# Altium project ESP32-S3-DevKitC-1 v1.1.PrjPcb
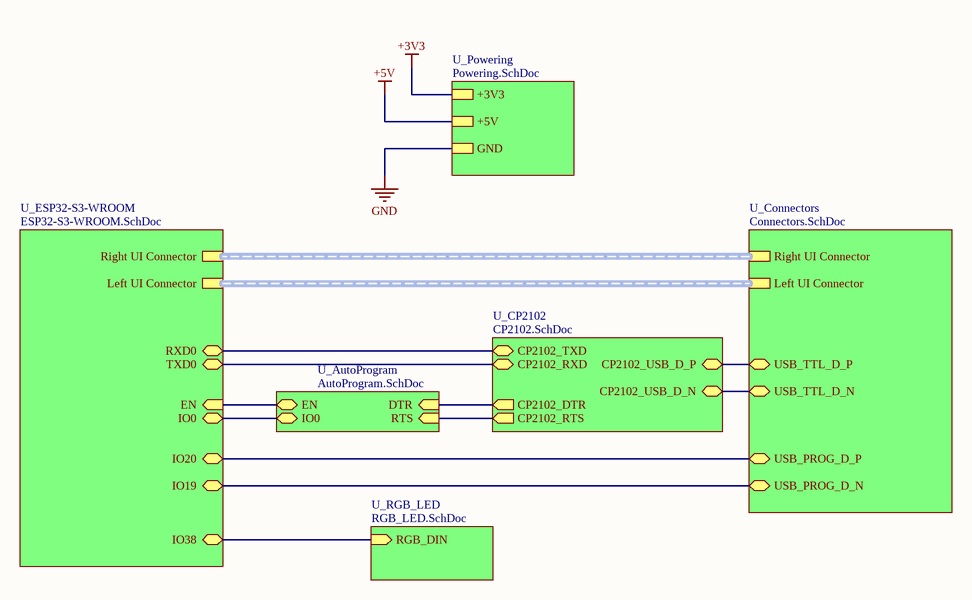
[diagram p0: Master.SchDoc]
Designer: Youssif Hossam; Version: 1.1
7 sheets, 50 parts. Net scope: hierarchical (ports join the sheet entries above them; power ports are global).
Board file: ESP32-S3-DevKitC-1.PcbDoc
Sheets:
  Master.SchDoc
    U_ESP32-S3-WROOM = ESP32-S3-WROOM.SchDoc
    U_Connectors = Connectors.SchDoc
    U_CP2102 = CP2102.SchDoc
    U_Powering = Powering.SchDoc
    U_RGB_LED = RGB_LED.SchDoc
    U_AutoProgram = AutoProgram.SchDoc

## Sheet Master.SchDoc
size A; SheetNumber: 1; SheetTotal: 7

### Sub-sheets
U_AutoProgram = AutoProgram.SchDoc: DTR (in), RTS (in), EN (bidir), IO0 (bidir)
U_Connectors = Connectors.SchDoc: Right UI Connector (harness Right UI Connector), Left UI Connector (harness Left UI Connector), USB_TTL_D_P (bidir), USB_TTL_D_N (bidir), USB_PROG_D_P (bidir), USB_PROG_D_N (bidir)
U_CP2102 = CP2102.SchDoc: CP2102_USB_D_P (bidir), CP2102_USB_D_N (bidir), CP2102_TXD (bidir), CP2102_RXD (bidir), CP2102_RTS (out), CP2102_DTR (out)
U_ESP32-S3-WROOM = ESP32-S3-WROOM.SchDoc: Right UI Connector (harness Right UI Connector), Left UI Connector (harness Left UI Connector), EN (in), RXD0 (bidir), TXD0 (bidir), IO0 (bidir), IO19 (bidir), IO20 (bidir), IO38 (bidir)
U_Powering = Powering.SchDoc: +3V3, +5V, GND
U_RGB_LED = RGB_LED.SchDoc: RGB_DIN (in)

### Nets
CP2102_RES_RXD: sheet U_ESP32-S3-WROOM/TXD0, sheet U_CP2102/CP2102_RXD
CP2102_RES_TXD: sheet U_ESP32-S3-WROOM/RXD0, sheet U_CP2102/CP2102_TXD
CP2102_USB_D_N: sheet U_Connectors/USB_TTL_D_N, sheet U_CP2102/CP2102_USB_D_N
CP2102_USB_D_P: sheet U_Connectors/USB_TTL_D_P, sheet U_CP2102/CP2102_USB_D_P
DTR: sheet U_CP2102/CP2102_DTR, sheet U_AutoProgram/DTR
EN: sheet U_ESP32-S3-WROOM/EN, sheet U_AutoProgram/EN
IO0: sheet U_ESP32-S3-WROOM/IO0, sheet U_AutoProgram/IO0
IO38: sheet U_ESP32-S3-WROOM/IO38, sheet U_RGB_LED/RGB_DIN
RTS: sheet U_CP2102/CP2102_RTS, sheet U_AutoProgram/RTS
USB1_D_N: sheet U_ESP32-S3-WROOM/IO19, sheet U_Connectors/USB_PROG_D_N
USB1_D_P: sheet U_ESP32-S3-WROOM/IO20, sheet U_Connectors/USB_PROG_D_P

### Buses and harness runs
harness sheet U_Connectors/Left UI Connector = sheet U_ESP32-S3-WROOM/Left UI Connector
harness sheet U_Connectors/Right UI Connector = sheet U_ESP32-S3-WROOM/Right UI Connector

## Sheet ESP32-S3-WROOM.SchDoc
size A; SheetNumber: 2; SheetTotal: 7
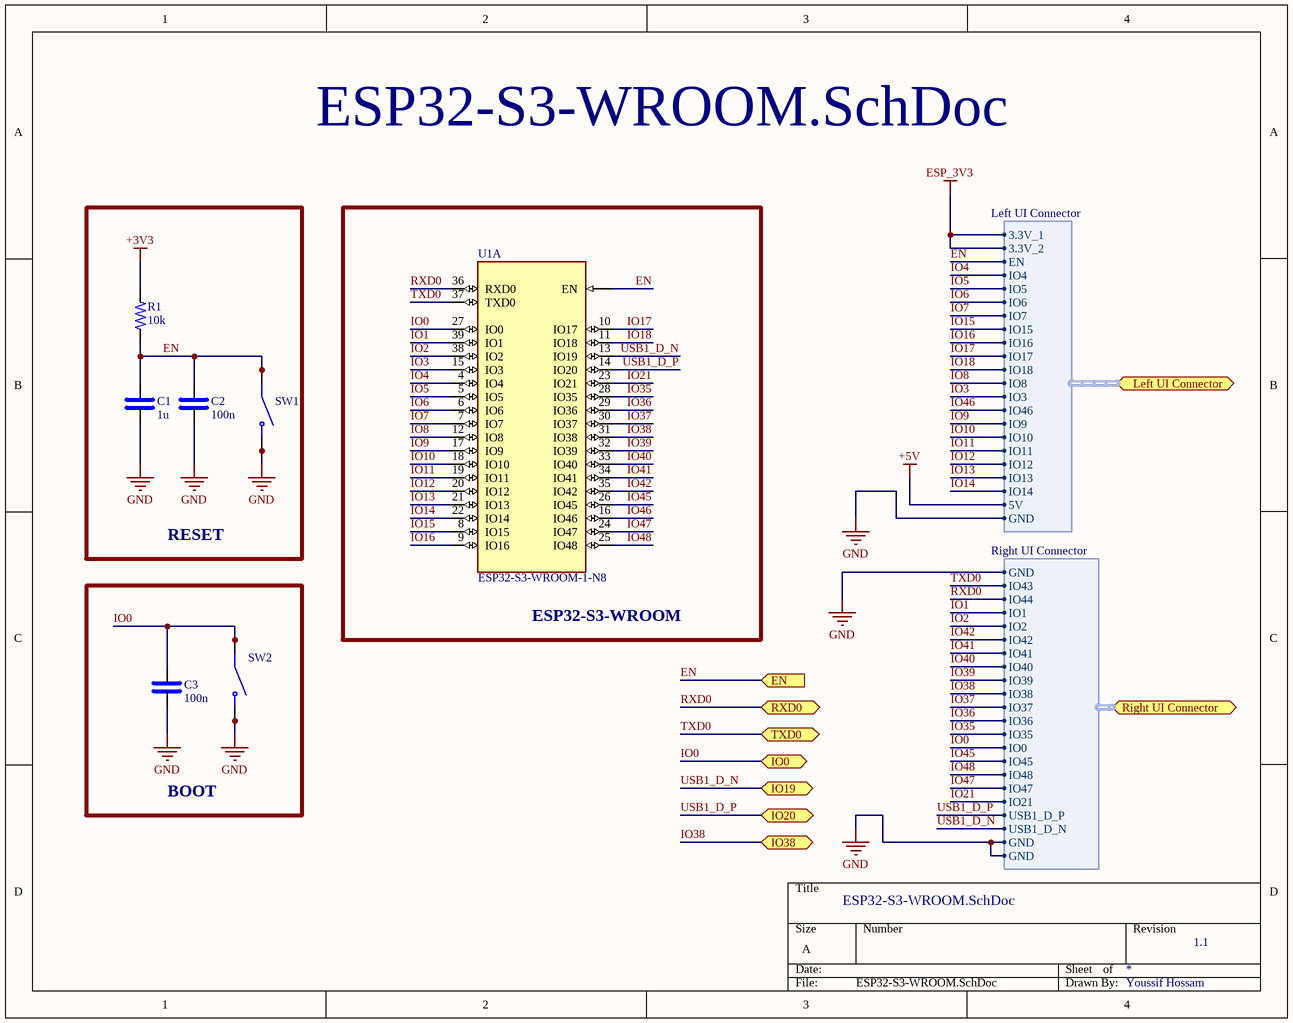
[diagram p1: ESP32-S3-WROOM.SchDoc]

### Parts
C1  1u  [FP-GCJ188-0_2-IPC_C]
C2  100n  [0402 CAP]
C3  100n  [0402 CAP]
R1  10k  [0402 RES]
SW1  KMR731NGLFS  [SW_KMR731NGLFS]  (value not drawn)
SW2  KMR731NGLFS  [SW_KMR731NGLFS]  (value not drawn)
U1  ESP32-S3-WROOM-1-N8  [XCVR_ESP32-S3-WROOM-1-N8]  (part A of 2)

### Blocks framed on the sheet
RESET: C1 C2 R1 SW1
ESP32-S3-WROOM: U1
BOOT: C3 SW2

### Ports
EN (in, see Master[2C], AutoProgram[4B]), IO0 (bidir, see Master[2C], AutoProgram[4B]), IO19 (bidir, see Master[2C]), IO20 (bidir, see Master[2C]), IO38 (bidir, see Master[2C]), Left UI Connector (bidir, harness Left UI Connector, see Master[2B], Connectors[2B]), Right UI Connector (bidir, harness Right UI Connector, see Master[2B], Connectors[4B]), RXD0 (bidir, see Master[2C]), TXD0 (bidir, see Master[2C])

### Harnesses
Right UI Connector: GND, IO43, IO44, IO1, IO2, IO35, IO36, IO37, IO38, IO39, IO40, IO41, IO42, IO0, IO45, IO48, IO47, USB1_D_N, USB1_D_P, IO21, GND, GND
Left UI Connector: 3.3V_1, 3.3V_2, EN, IO4, IO5, IO6, IO7, IO15, IO16, IO17, IO18, IO8, IO3, IO46, IO9, IO10, IO11, IO12, IO13, IO14, 5V, GND

### Nets
+3V3: R1.2
ESP_3V3: port Left UI Connector.3.3V_1, port Left UI Connector.3.3V_2
GND: C1.1 C2.1 C3.1 SW1.1(NO) SW1.2(NO) SW2.1(NO) SW2.2(NO) ; port Right UI Connector.GND, port Left UI Connector.GND
EN: C1.2 C2.2 R1.1 SW1.3(COM) SW1.4(COM) U1.3(EN) ; port EN, port Left UI Connector.EN
IO0: C3.2 SW2.3(COM) SW2.4(COM) U1.27(IO0) ; port IO0, port Right UI Connector.IO0
IO1: U1.39(IO1) ; port Right UI Connector.IO1
IO2: U1.38(IO2) ; port Right UI Connector.IO2
IO3: U1.15(IO3) ; port Left UI Connector.IO3
IO4: U1.4(IO4) ; port Left UI Connector.IO4
IO5: U1.5(IO5) ; port Left UI Connector.IO5
IO6: U1.6(IO6) ; port Left UI Connector.IO6
IO7: U1.7(IO7) ; port Left UI Connector.IO7
IO8: U1.12(IO8) ; port Left UI Connector.IO8
IO9: U1.17(IO9) ; port Left UI Connector.IO9
IO10: U1.18(IO10) ; port Left UI Connector.IO10
IO11: U1.19(IO11) ; port Left UI Connector.IO11
IO12: U1.20(IO12) ; port Left UI Connector.IO12
IO13: U1.21(IO13) ; port Left UI Connector.IO13
IO14: U1.22(IO14) ; port Left UI Connector.IO14
IO15: U1.8(IO15) ; port Left UI Connector.IO15
IO16: U1.9(IO16) ; port Left UI Connector.IO16
IO17: U1.10(IO17) ; port Left UI Connector.IO17
IO18: U1.11(IO18) ; port Left UI Connector.IO18
IO21: U1.23(IO21) ; port Right UI Connector.IO21
IO35: U1.28(IO35) ; port Right UI Connector.IO35
IO36: U1.29(IO36) ; port Right UI Connector.IO36
IO37: U1.30(IO37) ; port Right UI Connector.IO37
IO38: U1.31(IO38) ; port IO38, port Right UI Connector.IO38
IO39: U1.32(IO39) ; port Right UI Connector.IO39
IO40: U1.33(IO40) ; port Right UI Connector.IO40
IO41: U1.34(IO41) ; port Right UI Connector.IO41
IO42: U1.35(IO42) ; port Right UI Connector.IO42
IO45: U1.26(IO45) ; port Right UI Connector.IO45
IO46: U1.16(IO46) ; port Left UI Connector.IO46
IO47: U1.24(IO47) ; port Right UI Connector.IO47
IO48: U1.25(IO48) ; port Right UI Connector.IO48
RXD0: U1.36(RXD0) ; port RXD0, port Right UI Connector.IO44  [project net CP2102_RES_TXD]
TXD0: U1.37(TXD0) ; port TXD0, port Right UI Connector.IO43  [project net CP2102_RES_RXD]
USB1_D_N: U1.13(IO19) ; port IO19, port Right UI Connector.USB1_D_N
USB1_D_P: U1.14(IO20) ; port IO20, port Right UI Connector.USB1_D_P

### Library data of the parts
C1 = 0603 SMD CAP: Ceramic Capacitor, Multilayer, Ceramic, 16V, 10% +Tol, 10% -Tol, X5R, 15% TC, 1uF, Surface Mount, 0402; Manufacturer: Murata; Manufacturer Part Number: GRM188R61E106KA73D; Material: 4241ConductorMaterial; Dielectric: 1537DielectricType; Voltage Rating (DC): 25V; Multilayer: Yes; Supplier: Mouser; Supplier Part Number: 81-GRM188R61E106KA3D; RoHS: Yes; Category: Ceramic Capacitors; Stock: 343973; Pricing: 1=0.22, 10=0.073, 50=0.073, 100=0.054, 1000=0.05, 10000=0.038 (USD); Length: 1.6mm; Width: 800um; Height: 1mm; Thickness: 800um; ComponentLink1URL: https://datasheet.octopart.com/GRM188R61E106KA73D-Murata-datasheet-149523249.pdf?src-supplier=Newark; ComponentLink1Description: https://datasheet.octopart.com/GRM188R61E106KA73D-Murata-datasheet-149523249.pdf?src-supplier=Newark; ComponentLink2URL: https://search.murata.co.jp/Ceramy/image/img/A01X/G101/ENG/GRM188R61E106KA73-01.pdf?src-supplier=Digikey; ComponentLink2Description: https://search.murata.co.jp/Ceramy/image/img/A01X/G101/ENG/GRM188R61E106KA73-01.pdf?src-supplier=Digikey; ComponentLink3URL: https://datasheet.octopart.com/GRM188R61E106KA73D-Murata-datasheet-165579666.pdf?src-supplier=TME; ComponentLink3Description: https://datasheet.octopart.com/GRM188R61E106KA73D-Murata-datasheet-165579666.pdf?src-supplier=TME; Mounting Technology: Surface Mount; Pins: 2; Dielectric Material: Ceramic; Package Shape: Rectangular; Case/Package: 0402; Terminal Finish: Nickel; Min Operating Temperature: -55°C; Max Operating Temperature: 85°C; JESD-609 Code: e3; Value: 1uF; Capacitor Type: Ceramic; Tolerance  (fill in as +-): 10%; Package Style: SMTMeter; Packaging: Tape and Reel; Tolerance (fill in as +-): 10%; Rated DC Voltage (URdc): 16V; Temperature Characteristics Code: X5R; Termination: Wraparound; Reach SVHC Compliant: Yes; RoHS Compliant: Yes; ComponentLink4URL: https://datasheet.ciiva.com:443/pdfs/VipMasterIC/IC/TAIY/TAIY-S-A0009096450/TAIY-S-A0009096597-1.pdf?src-supplier=IHS+Markit; ComponentLink4Description: https://datasheet.ciiva.com:443/pdfs/VipMasterIC/IC/TAIY/TAIY-S-A0009096450/TAIY-S-A0009096597-1.pdf?src-supplier=IHS+Markit; ComponentLink5URL: https://datasheet.ciiva.com/134/emk105bj105kv-f-ss-134209.pdf?src-supplier=Digikey; ComponentLink5Description: https://datasheet.ciiva.com/134/emk105bj105kv-f-ss-134209.pdf?src-supplier=Digikey; ComponentLink6URL: https://datasheet.ciiva.com/15920/964emk105bj105kv-f-15920402.pdf?src-supplier=Onlinecomponents.com; ComponentLink6Description: https://datasheet.ciiva.com/15920/964emk105bj105kv-f-15920402.pdf?src-supplier=Onlinecomponents.com; ComponentLink7URL: https://datasheet.ciiva.com/26871/getdatasheetpartid-638287-26871289.pdf?src-supplier=Verical; ComponentLink7Description: https://datasheet.ciiva.com/26871/getdatasheetpartid-638287-26871289.pdf?src-supplier=Verical; ComponentLink8URL: https://datasheet.ciiva.com/30259/265emk105bj105kv-f-30259872.pdf?src-supplier=Onlinecomponents.com; ComponentLink8Description: https://datasheet.ciiva.com/30259/265emk105bj105kv-f-30259872.pdf?src-supplier=Onlinecomponents.com; ComponentLink9URL: https://datasheet.ciiva.com/7657/1497285-7657320.pdf?src-supplier=Element14; ComponentLink9Description: https://datasheet.ciiva.com/7657/1497285-7657320.pdf?src-supplier=Element14; ComponentLink10URL: https://datasheet.ciiva.com/22694/1497285-22694239.pdf?src-supplier=Element14; ComponentLink10Description: https://datasheet.ciiva.com/22694/1497285-22694239.pdf?src-supplier=Element14; ComponentLink11URL: https://datasheet.ciiva.com/5424/mlcc01-e-5424190.pdf?src-supplier=Mouser; ComponentLink11Description: https://datasheet.ciiva.com/5424/mlcc01-e-5424190.pdf?src-supplier=Mouser
C2 C3 = 0402 SMD Capacitor: Multilayer Ceramic Capacitor, 0.1 uF, 25 V, ï¿½ 10%, X7R, 0402 [1005 Metric]; Manufacturer: Samsung; Manufacturer Part Number: CL05B104KA5NNNC; Material: 4241ConductorMaterial; Value: 100nF; Voltage Rating: 25V; ComponentLink1Description: Link; ComponentLink1URL: *; Supplier: Digikey; Supplier Part Number: 1276-6720-1-ND; RoHS: Yes; Category: Ceramic Capacitors; Stock: 9938397; Pricing: 1=0.08, 10=0.006, 50=0.0056, 100=0.0048, 500=0.0044, 1000=0.004, 2500=0.0032 (USD); Mounting Technology: Surface Mount; Case/Package: 0402; Case Code (Metric): 1005; Case Code (Imperial): 0402; Min Operating Temperature: -55°C; Max Operating Temperature: 125°C; Packaging: Cut Tape; Tolerance: 10%; Series: CL; Voltage Rating (DC): 25V; Length: 0.039inch; Width: 0.02inch; Height: 550um; Thickness: 0.022inch; RoHS Compliant: Yes; ComponentLink2URL: https://datasheet.octopart.com/CL05B104KA5NNNC-Samsung-Electro-Mechanics-datasheet-116890910.pdf?src-supplier=Future+Electronics; ComponentLink2Description: https://datasheet.octopart.com/CL05B104KA5NNNC-Samsung-Electro-Mechanics-datasheet-116890910.pdf?src-supplier=Future+Electronics; ComponentLink3URL: http://www.samsungsem.com/kr/support/product-search/mlcc/CL05B104KA5NNNC.jsp?src-supplier=Digikey; ComponentLink3Description: http://www.samsungsem.com/kr/support/product-search/mlcc/CL05B104KA5NNNC.jsp?src-supplier=Digikey
R1 = 0402 SMD Resistor: Res Thick Film 0402 10K Ohm 5% 0.125W(1/8W) ±200ppm/C Pad SMD T/R; Manufacturer: Yageo; Manufacturer Part Number: RC0402JR-7W10KL; Value: 10kR; ComponentLink1Description: Link; ComponentLink1URL: *; Supplier: Future Electronics; Supplier Part Number: 5143940; RoHS: Yes; Category: Chip SMD Resistors; Stock: 480000; Pricing: 10000=0.0009, 50000=0.0009, 200000=0.0009, 500000=0.0009, 1250000=0.0009 (USD); Case/Package: 343Case; Packaging: 10Packaging; RoHS Compliant: Yes; ComponentLink2URL: https://datasheet.octopart.com/RC0402JR-7W10KL-Yageo-datasheet-164759695.pdf?src-supplier=Future+Electronics; ComponentLink2Description: https://datasheet.octopart.com/RC0402JR-7W10KL-Yageo-datasheet-164759695.pdf?src-supplier=Future+Electronics
SW1 SW2 = KMR731NGLFS: Tactile Switch SPST-NO Top Actuated Surface Mount; MF: C&K; Value: *; MP: KMR731NGLFS; Purchase-URL: https://pricing.snapeda.com/search/part/KMR731NGLFS/?ref=eda; Package: None; SnapEDA_Link: https://www.snapeda.com/parts/KMR731NGLFS/C&K/view-part/700258/?ref=snap; Price: None; Availability: Good
U1 = ESP32-S3-WROOM-1-N8: <a href="https://pricing.snapeda.com/parts/ESP32S3WROOM1N8R8/Espressif%20Systems/view-part?ref=eda">Check availability</a>  <a href="https://pricing.snapeda.com/parts/ESP32-S3-WROOM-1-N8R8/Espressif%20Systems/view-part?ref=eda">Check availability</a>; pin to pad: 1>1+40+41_1+41_2+41_3+41_4+41_5+41_6+41_7+41_8+41_9+41_10+41_11+41_12+41_13+41_14+41_15+41_16+41_17+41_18+41_19+41_20+41_21; MF: {'manufacturer': u'Espressif Systems'}; Package: None; Price: None; Value: *; MP: ESP32-S3-WROOM-1-N8; Availability: Unavailable

## Sheet Connectors.SchDoc
size B; SheetNumber: 4; SheetTotal: 7
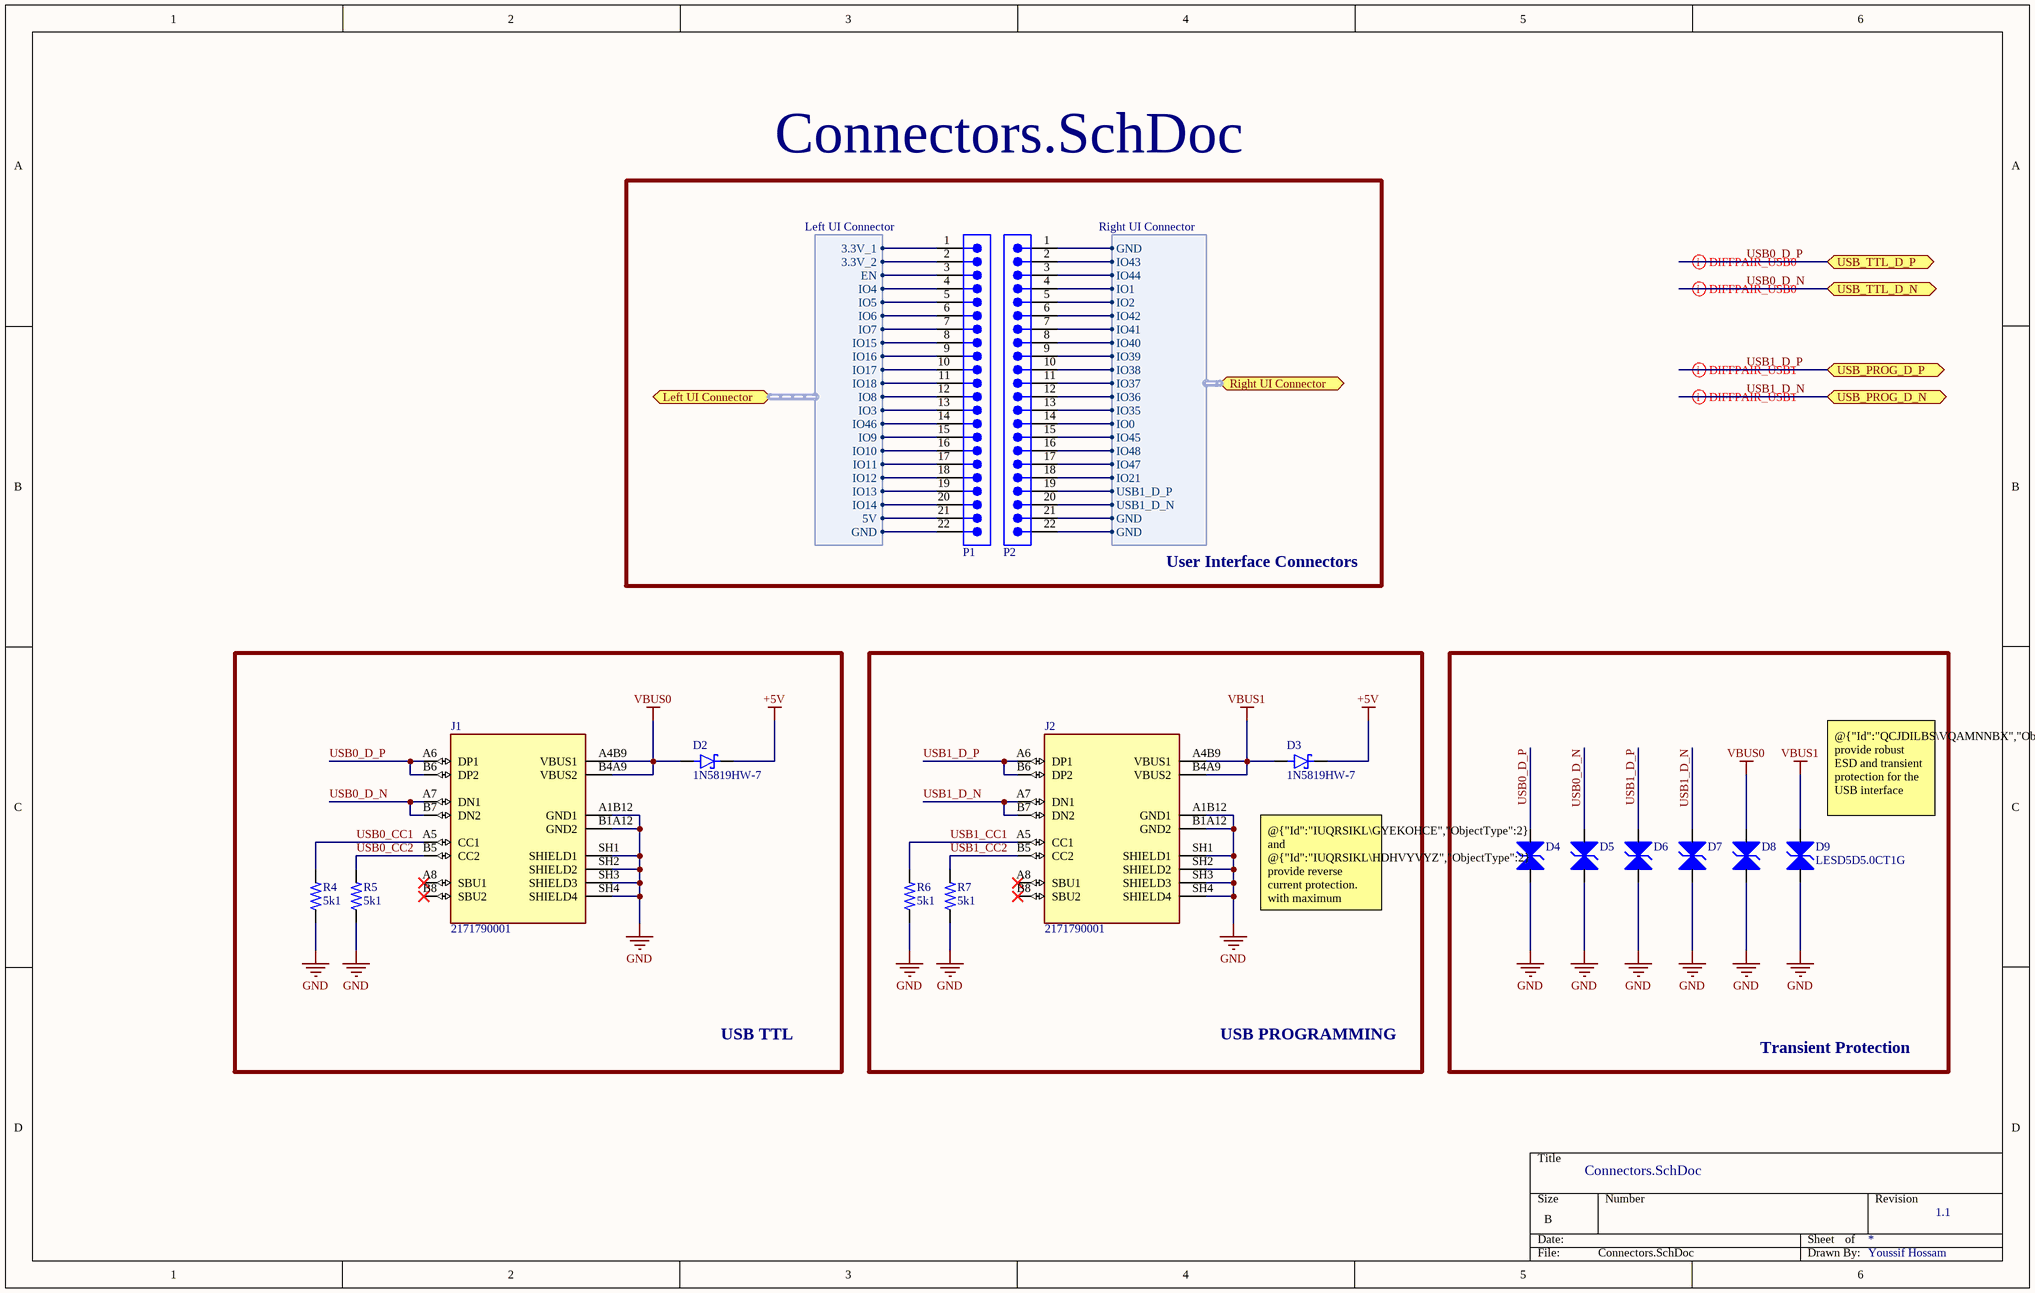
[diagram p2: Connectors.SchDoc]

### Parts
D2  1N5819HW-7  [SOD3715X145N]
D3  1N5819HW-7  [SOD3715X145N]
D4  LESD5D5.0CT1G  [TVS_LESD5D5.0CT1G]  (value not drawn)
D5  LESD5D5.0CT1G  [TVS_LESD5D5.0CT1G]  (value not drawn)
D6  LESD5D5.0CT1G  [TVS_LESD5D5.0CT1G]  (value not drawn)
D7  LESD5D5.0CT1G  [TVS_LESD5D5.0CT1G]  (value not drawn)
D8  LESD5D5.0CT1G  [TVS_LESD5D5.0CT1G]  (value not drawn)
D9  LESD5D5.0CT1G  [TVS_LESD5D5.0CT1G]
J1  2171790001  [MOLEX_2171790001]
J2  2171790001  [MOLEX_2171790001]
P1  61302211121  [61302211121]  (value not drawn)
P2  61302211121  [61302211121]  (value not drawn)
R4  5k1  [0402 RES]
R5  5k1  [0402 RES]
R6  5k1  [0402 RES]
R7  5k1  [0402 RES]

### Blocks framed on the sheet
User Interface Connectors: P1 P2
USB TTL: D2 J1 R4 R5
USB PROGRAMMING: D3 J2 R6 R7
Transient Protection: D4-D9

### Ports
Left UI Connector (bidir, harness Left UI Connector, see Master[3B], ESP32-S3-WROOM[4B]), Right UI Connector (bidir, harness Right UI Connector, see Master[3B], ESP32-S3-WROOM[4C]), USB_PROG_D_N (bidir, see Master[3C]), USB_PROG_D_P (bidir, see Master[3C]), USB_TTL_D_N (bidir, see Master[3C]), USB_TTL_D_P (bidir, see Master[3C])

### Harnesses
Right UI Connector: GND, IO43, IO44, IO1, IO2, IO35, IO36, IO37, IO38, IO39, IO40, IO41, IO42, IO0, IO45, IO48, IO47, USB1_D_N, USB1_D_P, IO21, GND, GND
Left UI Connector: 3.3V_1, 3.3V_2, EN, IO4, IO5, IO6, IO7, IO15, IO16, IO17, IO18, IO8, IO3, IO46, IO9, IO10, IO11, IO12, IO13, IO14, 5V, GND

### Nets
+5V: D2.C(K) D3.C(K) P1.21 ; port Left UI Connector.5V
ESP_3V3: P1.1 P1.2 ; port Left UI Connector.3.3V_1, port Left UI Connector.3.3V_2
GND: D4.1 D5.1 D6.1 D7.1 D8.1 D9.1 J1.A1B12(GND1) J1.B1A12(GND2) J1.SH1(SHIELD1) J1.SH2(SHIELD2) J1.SH3(SHIELD3) J1.SH4(SHIELD4) J2.A1B12(GND1) J2.B1A12(GND2) J2.SH1(SHIELD1) J2.SH2(SHIELD2) J2.SH3(SHIELD3) J2.SH4(SHIELD4) P1.22 P2.1 P2.21 P2.22 R4.1 R5.1 R6.1 R7.1 ; port Right UI Connector.GND, port Left UI Connector.GND
VBUS0: D2.A D8.2 J1.A4B9(VBUS1) J1.B4A9(VBUS2)
VBUS1: D3.A D9.2 J2.A4B9(VBUS1) J2.B4A9(VBUS2)
CP2102_RES_RXD: P2.2 ; port Right UI Connector.IO43
CP2102_RES_TXD: P2.3 ; port Right UI Connector.IO44
EN: P1.3 ; port Left UI Connector.EN
IO0: P2.14 ; port Right UI Connector.IO0
IO1: P2.4 ; port Right UI Connector.IO1
IO2: P2.5 ; port Right UI Connector.IO2
IO3: P1.13 ; port Left UI Connector.IO3
IO4: P1.4 ; port Left UI Connector.IO4
IO5: P1.5 ; port Left UI Connector.IO5
IO6: P1.6 ; port Left UI Connector.IO6
IO7: P1.7 ; port Left UI Connector.IO7
IO8: P1.12 ; port Left UI Connector.IO8
IO9: P1.15 ; port Left UI Connector.IO9
IO10: P1.16 ; port Left UI Connector.IO10
IO11: P1.17 ; port Left UI Connector.IO11
IO12: P1.18 ; port Left UI Connector.IO12
IO13: P1.19 ; port Left UI Connector.IO13
IO14: P1.20 ; port Left UI Connector.IO14
IO15: P1.8 ; port Left UI Connector.IO15
IO16: P1.9 ; port Left UI Connector.IO16
IO17: P1.10 ; port Left UI Connector.IO17
IO18: P1.11 ; port Left UI Connector.IO18
IO21: P2.18 ; port Right UI Connector.IO21
IO35: P2.13 ; port Right UI Connector.IO35
IO36: P2.12 ; port Right UI Connector.IO36
IO37: P2.11 ; port Right UI Connector.IO37
IO38: P2.10 ; port Right UI Connector.IO38
IO39: P2.9 ; port Right UI Connector.IO39
IO40: P2.8 ; port Right UI Connector.IO40
IO41: P2.7 ; port Right UI Connector.IO41
IO42: P2.6 ; port Right UI Connector.IO42
IO45: P2.15 ; port Right UI Connector.IO45
IO46: P1.14 ; port Left UI Connector.IO46
IO47: P2.17 ; port Right UI Connector.IO47
IO48: P2.16 ; port Right UI Connector.IO48
USB0_CC1: J1.A5(CC1) R4.2
USB0_CC2: J1.B5(CC2) R5.2
USB0_D_N: D5.2 J1.A7(DN1) J1.B7(DN2) ; port USB_TTL_D_N  [project net CP2102_USB_D_N]
USB0_D_P: D4.2 J1.A6(DP1) J1.B6(DP2) ; port USB_TTL_D_P  [project net CP2102_USB_D_P]
USB1_CC1: J2.A5(CC1) R6.2
USB1_CC2: J2.B5(CC2) R7.2
USB1_D_N: D7.2 J2.A7(DN1) J2.B7(DN2) P2.20 ; port USB_PROG_D_N, port Right UI Connector.USB1_D_N
USB1_D_P: D6.2 J2.A6(DP1) J2.B6(DP2) P2.19 ; port USB_PROG_D_P, port Right UI Connector.USB1_D_P

Not connected (* = marked no-connect by the designer): J1 A8(SBU1)* B8(SBU2)*; J2 A8(SBU1)* B8(SBU2)*

### Layout directives
differential pair; differential pair class DIFFPAIR_USB: CP2102_USB_D_N, CP2102_USB_D_P, USB1_D_N, USB1_D_P

### Notes on the sheet
- (near D9) @{"Id":"QCJDILBS\VQAMNNBX","ObjectType":2}:@{"Id":"QCJDILBS\IDLQJVSX","ObjectType":2} provide robust ESD and transient protection for the USB interface
- @{"Id":"IUQRSIKL\GYEKOHCE","ObjectType":2} and @{"Id":"IUQRSIKL\HDHVYVYZ","ObjectType":2} provide reverse current protection. with maximum forward voltage 0.75V

### Library data of the parts
D2 D3 = 1N5819HW-7: Diode Schottky 40 V 1A Surface Mount SOD-123; MF: Diodes Inc.; SnapEDA_Link: https://www.snapeda.com/parts/1N5819HW-7/Diodes+Inc./view-part/?ref=snap; Price: None; Check_prices: https://www.snapeda.com/parts/1N5819HW-7/Diodes+Inc./view-part/?ref=eda; Availability: In Stock; Value: *; MP: 1N5819HW-7; Package: SOD-123 Fairchild Semiconductor; Purchase-URL: https://pricing.snapeda.com/search/part/1N5819HW-7/?ref=eda
D4-D9 = LESD5D5.0CT1G: Transient Voltage Suppressors for ESD Protection; MF: Leshan Radio Co.; Check_prices: https://www.snapeda.com/parts/LESD5D5.0CT1G/Leshan+Radio+Co./view-part/?ref=eda; Value: *; Availability: Not in stock; Package: None; SnapEDA_Link: https://www.snapeda.com/parts/LESD5D5.0CT1G/Leshan+Radio+Co./view-part/?ref=snap; MP: LESD5D5.0CT1G; Price: None
J1 J2 = 2171790001: USB Type C - Connector, Top-mount SMT, 16pos | Molex Incorporated 217179-0001; SnapEDA_Link: https://www.snapeda.com/parts/217179-0001/Molex/view-part/?ref=snap; Package: None; Value: *; MF: Molex; MP: 217179-0001; Check_prices: https://www.snapeda.com/parts/217179-0001/Molex/view-part/?ref=eda
P1 P2 = 61302211121: WR-PHD Pin Header, THT, Vertical, pitch 2.54mm, 1 Row, 22P; Manufacturer: Wurth Elektronik; Contact Resistance: 20mOhm; Rated Current: 3A; Working Voltage: 250V; Withstanding Voltage: 500V; Manufacturer Part Number: 61302211121; Category: Board-to-Board Connectors; Match Code: WR-PHD; ComponentLink1Description: Website Link; ComponentLink1URL: https://www.we-online.com/redexpert/article/61302211121?ad; ComponentLink2Description: Datasheet Link; ComponentLink2URL: https://www.we-online.com/redexpert/spec/61302211121?ad; Mount: Through Hole; Operating Temperature Max: 105°C; Operating Temperature Min: -40°C; Packaging: Bag; Gender: Pin Header; Number of Pins: 22; Number of Rows: 1; Orientation: Vertical; Pitch: 2.54mm
R4-R7 = 0402 SMD Resistor: General Purpose Chip Resistor Thick Film 0402 5.1kOhm 1% Paper T/R; Manufacturer: Yageo; Manufacturer Part Number: RC0402FR-7W5K1L; Value: 5.1kR; ComponentLink1Description: Link; ComponentLink1URL: *; Supplier: Digikey; Supplier Part Number: 13-RC0402FR-7W5K1LCT-ND; RoHS: Yes; Category: Chip SMD Resistors; Stock: 6352; Pricing: 1=0.1, 10=0.021, 50=0.0164, 100=0.0112, 500=0.00868, 1000=0.00612, 5000=0.0051 (USD); Case/Package: 343Case; Packaging: 10Packaging; RoHS Compliant: Yes

## Sheet CP2102.SchDoc
size A; SheetNumber: 5; SheetTotal: 7
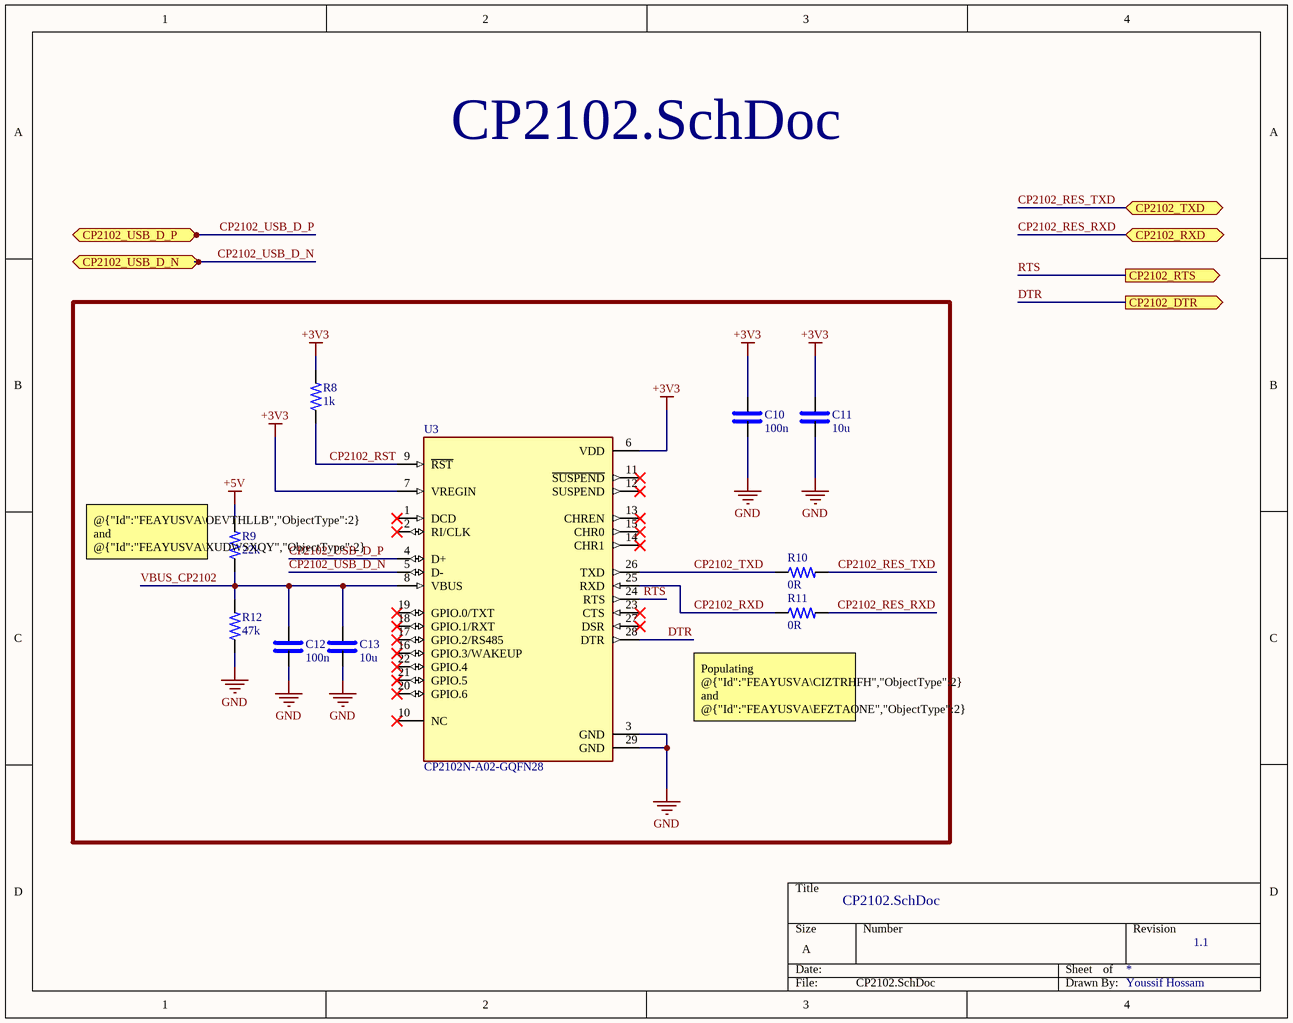
[diagram p3: CP2102.SchDoc]

### Parts
C10  100n  [0402 CAP]
C11  10u  [FP-GCJ188-0_2-IPC_C]
C12  100n  [0402 CAP]
C13  10u  [FP-GCJ188-0_2-IPC_C]
R8  1k  [0402 RES]
R9  22k  [0402 RES]
R10  0R  [0402 RES]
R11  0R  [0402 RES]
R12  47k  [0402 RES]
U3  CP2102N-A02-GQFN28  [QFN50P500X500X80-29N]

### Ports
CP2102_DTR (out, see Master[2C]), CP2102_RTS (out, see Master[2C]), CP2102_RXD (bidir, see Master[2C]), CP2102_TXD (bidir, see Master[2C]), CP2102_USB_D_N (bidir, see Master[3C]), CP2102_USB_D_P (bidir, see Master[3C])

### Nets
+3V3: C10.2 C11.2 R8.2 U3.6(VDD) U3.7(VREGIN)
+5V: R9.2
GND: C10.1 C11.1 C12.1 C13.1 R12.1 U3.3(GND) U3.29(GND)
CP2102_RES_RXD: R11.2 ; port CP2102_RXD
CP2102_RES_TXD: R10.2 ; port CP2102_TXD
CP2102_RST: R8.1 U3.9(~{RST})
CP2102_RXD: R11.1 U3.25(RXD)
CP2102_TXD: R10.1 U3.26(TXD)
CP2102_USB_D_N: U3.5(D-) ; port CP2102_USB_D_N
CP2102_USB_D_P: U3.4(D+) ; port CP2102_USB_D_P
DTR: U3.28(DTR) ; port CP2102_DTR
RTS: U3.24(RTS) ; port CP2102_RTS
VBUS_CP2102: C12.2 C13.2 R9.1 R12.2 U3.8(VBUS)

Not connected (* = marked no-connect by the designer): U3 1(DCD)* 2(RI/CLK)* 10(NC)* 11(~{SUSPEND})* 12(SUSPEND)* 13(CHREN)* 14(CHR1)* 15(CHR0)* 16(GPIO.3/WAKEUP)* 17(GPIO.2/RS485)* 18(GPIO.1/RXT)* 19(GPIO.0/TXT)* 20(GPIO.6)* 21(GPIO.5)* 22(GPIO.4)* 23(CTS)* 27(DSR)*

### Notes on the sheet
- (near R9) @{"Id":"FEAYUSVA\OEVTHLLB","ObjectType":2} and @{"Id":"FEAYUSVA\XUDWSXQY","ObjectType":2} are used to drop out the voltage to 3.3V
- (near R11) Populating @{"Id":"FEAYUSVA\CIZTRHFH","ObjectType":2} and @{"Id":"FEAYUSVA\EFZTAONE","ObjectType":2} is a must to program the ESP32 via UART.

### Library data of the parts
C10 C12 = 0402 SMD Capacitor: as C2 on sheet ESP32-S3-WROOM; ComponentLink1Description: Link; ComponentLink1URL: *; Supplier: Digikey; Supplier Part Number: 1276-6720-1-ND; RoHS: Yes; Category: Ceramic Capacitors; Stock: 9938397; Pricing: 1=0.08, 10=0.006, 50=0.0056, 100=0.0048, 500=0.0044, 1000=0.004, 2500=0.0032 (USD); Mounting Technology: Surface Mount; Case/Package: 0402; Case Code (Metric): 1005; Case Code (Imperial): 0402; Min Operating Temperature: -55°C; Max Operating Temperature: 125°C; Packaging: Cut Tape; Tolerance: 10%; Series: CL; Voltage Rating (DC): 25V; Length: 0.039inch; Width: 0.02inch; Height: 550um; Thickness: 0.022inch; RoHS Compliant: Yes; ComponentLink2URL: https://datasheet.octopart.com/CL05B104KA5NNNC-Samsung-Electro-Mechanics-datasheet-116890910.pdf?src-supplier=Future+Electronics; ComponentLink2Description: https://datasheet.octopart.com/CL05B104KA5NNNC-Samsung-Electro-Mechanics-datasheet-116890910.pdf?src-supplier=Future+Electronics; ComponentLink3URL: http://www.samsungsem.com/kr/support/product-search/mlcc/CL05B104KA5NNNC.jsp?src-supplier=Digikey; ComponentLink3Description: http://www.samsungsem.com/kr/support/product-search/mlcc/CL05B104KA5NNNC.jsp?src-supplier=Digikey
C11 C13 = 0603 SMD CAP: Multilayer Ceramic Capacitor, 10 uF, 25 V, ï¿½ 10%, X5R, 0603 [1608 Metric]; Manufacturer: Murata; Manufacturer Part Number: GRM188R61E106KA73D; Material: 4241ConductorMaterial; Dielectric: 1537DielectricType; Voltage Rating (DC): 25V; Supplier: Mouser; Supplier Part Number: 81-GRM188R61E106KA3D; RoHS: Yes; Category: Ceramic Capacitors; Stock: 343973; Pricing: 1=0.22, 10=0.073, 50=0.073, 100=0.054, 1000=0.05, 10000=0.038 (USD); Length: 1.6mm; Width: 800um; Height: 1mm; Thickness: 800um; ComponentLink1URL: https://datasheet.octopart.com/GRM188R61E106KA73D-Murata-datasheet-149523249.pdf?src-supplier=Newark; ComponentLink1Description: https://datasheet.octopart.com/GRM188R61E106KA73D-Murata-datasheet-149523249.pdf?src-supplier=Newark; ComponentLink2URL: https://search.murata.co.jp/Ceramy/image/img/A01X/G101/ENG/GRM188R61E106KA73-01.pdf?src-supplier=Digikey; ComponentLink2Description: https://search.murata.co.jp/Ceramy/image/img/A01X/G101/ENG/GRM188R61E106KA73-01.pdf?src-supplier=Digikey; ComponentLink3URL: https://datasheet.octopart.com/GRM188R61E106KA73D-Murata-datasheet-165579666.pdf?src-supplier=TME; ComponentLink3Description: https://datasheet.octopart.com/GRM188R61E106KA73D-Murata-datasheet-165579666.pdf?src-supplier=TME
R8 = 0402 SMD Resistor: Res Thick Film 0402 1K Ohm 1% 0.125W(1/8W) ±200ppm/C Pad SMD T/R; Manufacturer: Yageo; Manufacturer Part Number: RC0402FR-7W1KL; Value: 1kR; ComponentLink1Description: Link; ComponentLink1URL: *; Supplier: Digikey; Supplier Part Number: 13-RC0402FR-7W1KLCT-ND; RoHS: Yes; Category: Chip SMD Resistors; Stock: 22503; Pricing: 1=0.1, 10=0.013, 50=0.0108, 100=0.0082, 500=0.00714, 1000=0.00612, 5000=0.0051 (USD); Case/Package: 343Case; Packaging: 10Packaging; ComponentLink2URL: https://datasheet.octopart.com/RC0402FR-7W1KL-Yageo-datasheet-164759695.pdf?src-supplier=Newark; ComponentLink2Description: https://datasheet.octopart.com/RC0402FR-7W1KL-Yageo-datasheet-164759695.pdf?src-supplier=Newark
R9 = 0402 SMD Resistor: SMD Chip Resistor, 22 kOhm, ± 1%, 125 mW, 0402 [1005 Metric], Thick Film, General Purpose; Manufacturer: Yageo; Manufacturer Part Number: RC0402FR-7W1KL; Value: 1kR; Power Rating: 125mW; Temperature Coefficient: 100ppm/°C; Voltage Rating: 50V; ComponentLink1Description: Link; ComponentLink1URL: *; Supplier: Digikey; Supplier Part Number: 13-RC0402FR-7W1KLCT-ND; RoHS: Yes; Category: Chip SMD Resistors; Stock: 22503; Pricing: 1=0.1, 10=0.013, 50=0.0108, 100=0.0082, 500=0.00714, 1000=0.00612, 5000=0.0051 (USD); Case/Package: 343Case; Packaging: 10Packaging; ComponentLink2URL: https://datasheet.octopart.com/RC0402FR-7W1KL-Yageo-datasheet-164759695.pdf?src-supplier=Newark; ComponentLink2Description: https://datasheet.octopart.com/RC0402FR-7W1KL-Yageo-datasheet-164759695.pdf?src-supplier=Newark; Min Operating Temperature: -55°C; Max Operating Temperature: 155°C; Tolerance: 1%; Height: 370um; ComponentLink3URL: https://datasheet.octopart.com/AC0402FR-7W22KL-Yageo-datasheet-151884373.pdf?src-supplier=Future+Electronics; ComponentLink3Description: https://datasheet.octopart.com/AC0402FR-7W22KL-Yageo-datasheet-151884373.pdf?src-supplier=Future+Electronics
R10 R11 = 0402 SMD Resistor: SMD Chip Resistor, Jumper, 0 ohm, 100 mW, 0402 [1005 Metric], Thick Film, General Purpose; Manufacturer: Panasonic; Manufacturer Part Number: ERJ-2GE0R00X; Value: 0mR; Power Rating: 100mW; Voltage Rating: 50V; Temperature Coefficient: 600ppm/°C; ComponentLink1Description: Link; ComponentLink1URL: *; Supplier: Mouser; Supplier Part Number: 667-ERJ-2GE0R00X; RoHS: Yes; Category: Chip SMD Resistors; Stock: 616486; Pricing: 1=0.1, 10=0.013, 50=0.013, 100=0.008, 1000=0.006, 10000=0.004 (USD); Mounting Technology: Surface Mount; Case/Package: 0402; Pins: 2NUMBER; Contact Plating: Tin; Case Code (Metric): 1005; Case Code (Imperial): 0402; Min Operating Temperature: -55°C; Max Operating Temperature: 155°C; Resistor Type: Thick Film; Packaging: Cut Tape; Package Quantity: 10000; Number of Terminations: 2; Termination: SMD/SMT; Max Power Dissipation: 100mW; Features: Automotive AEC-Q200; Series: ERJ; Construction: Rectangular; Technology: THICK FILM; Voltage Rating (DC): 50V; Length: 1mm; Width: 0.5mm; Height: 0.35mm; Depth: 0.5mm; Ratings: AEC-Q200; Radiation Hardening: No; Reach SVHC Compliant: No; Military Standard: Not; RoHS Compliant: Yes; Lead Free: 5697LeadFree; ComponentLink2URL: https://datasheet.ciiva.com/11821/0900766b80f806dd-11821176.pdf?src-supplier=Rs; ComponentLink2Description: https://datasheet.ciiva.com/11821/0900766b80f806dd-11821176.pdf?src-supplier=Rs; ComponentLink3URL: https://datasheet.ciiva.com/46389/1678796-46389518.pdf?src-supplier=Element14; ComponentLink3Description: https://datasheet.ciiva.com/46389/1678796-46389518.pdf?src-supplier=Element14; ComponentLink4URL: https://datasheet.ciiva.com/28695/1678796-28695758.pdf?src-supplier=Element14; ComponentLink4Description: https://datasheet.ciiva.com/28695/1678796-28695758.pdf?src-supplier=Element14; ComponentLink5URL: https://datasheet.ciiva.com/16778/70260739-16778335.pdf?src-supplier=Allied+Electronics; ComponentLink5Description: https://datasheet.ciiva.com/16778/70260739-16778335.pdf?src-supplier=Allied+Electronics; ComponentLink6URL: https://datasheet.ciiva.com/48531/aoa0000ce1-48531077.pdf?src-supplier=Avnet; ComponentLink6Description: https://datasheet.ciiva.com/48531/aoa0000ce1-48531077.pdf?src-supplier=Avnet; ComponentLink7URL: https://datasheet.ciiva.com/30097/4aoa0000ce1-30097116.pdf?src-supplier=Onlinecomponents.com; ComponentLink7Description: https://datasheet.ciiva.com/30097/4aoa0000ce1-30097116.pdf?src-supplier=Onlinecomponents.com; ComponentLink8URL: https://datasheet.ciiva.com/43460/1678796-43460347.pdf?src-supplier=Farnell; ComponentLink8Description: https://datasheet.ciiva.com/43460/1678796-43460347.pdf?src-supplier=Farnell; ComponentLink9URL: https://datasheet.ciiva.com/5959/1678796-5959692.pdf?src-supplier=Farnell; ComponentLink9Description: https://datasheet.ciiva.com/5959/1678796-5959692.pdf?src-supplier=Farnell; ComponentLink10URL: https://datasheet.ciiva.com/16783/70260739-16783734.pdf?src-supplier=Allied+Electronics; ComponentLink10Description: https://datasheet.ciiva.com/16783/70260739-16783734.pdf?src-supplier=Allied+Electronics
R12 = 0402 SMD Resistor: Res, 47K, 1%, 0.125W, Thick Film, 0402 Rohs Compliant: Yes |Vishay RCC040247K0FKED; Manufacturer: Yageo; Manufacturer Part Number: RC0402FR-7W1KL; Value: 1kR; Power Rating: 125mW; Temperature Coefficient: 100ppm/°C; Voltage Rating: 75V; ComponentLink1Description: Link; ComponentLink1URL: *; Supplier: Digikey; Supplier Part Number: 13-RC0402FR-7W1KLCT-ND; RoHS: Yes; Category: Chip SMD Resistors; Stock: 22503; Pricing: 1=0.1, 10=0.013, 50=0.0108, 100=0.0082, 500=0.00714, 1000=0.00612, 5000=0.0051 (USD); Case/Package: 343Case; Packaging: 10Packaging; ComponentLink2URL: https://datasheet.octopart.com/RC0402FR-7W1KL-Yageo-datasheet-164759695.pdf?src-supplier=Newark; ComponentLink2Description: https://datasheet.octopart.com/RC0402FR-7W1KL-Yageo-datasheet-164759695.pdf?src-supplier=Newark; Min Operating Temperature: -55°C; Max Operating Temperature: 155°C; Tolerance: 1%; Height: 400um; RoHS Compliant: Yes
U3 = CP2102N-A02-GQFN28: USB Bridge, USB to UART USB 2.0 UART Interface 28-QFN (5x5); MF: Silicon Labs; Value: *; Price: None; Package: WFQFN-28 Silicon Labs; Check_prices: https://www.snapeda.com/parts/CP2102N-A02-GQFN28/Silicon+Labs/view-part/?ref=eda; Availability: In Stock; SnapEDA_Link: https://www.snapeda.com/parts/CP2102N-A02-GQFN28/Silicon+Labs/view-part/?ref=snap; Purchase-URL: https://pricing.snapeda.com/search/part/CP2102N-A02-GQFN28/?ref=eda; MP: CP2102N-A02-GQFN28

## Sheet Powering.SchDoc
size A; SheetNumber: 3; SheetTotal: 7
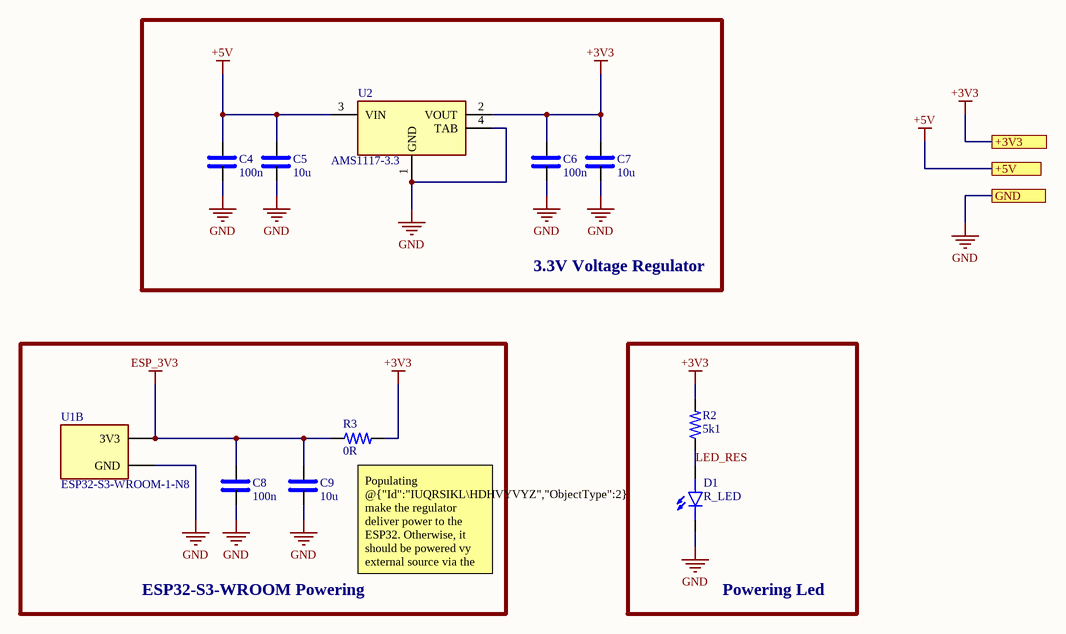
[diagram p4: Powering.SchDoc]

### Parts
C4  100n  [0402 CAP]
C5  10u  [FP-GCJ188-0_2-IPC_C]
C6  100n  [0402 CAP]
C7  10u  [FP-GCJ188-0_2-IPC_C]
C8  100n  [0402 CAP]
C9  10u  [FP-GCJ188-0_2-IPC_C]
D1  R_LED  [LEDC2012X70N]
R2  5k1  [0402 RES]
R3  0R  [0402 RES]
U1  ESP32-S3-WROOM-1-N8  [XCVR_ESP32-S3-WROOM-1-N8]  (part B of 2)
U2  AMS1117-3.3  [SOT229P700X180-4N]

### Blocks framed on the sheet
3.3V Voltage Regulator: C4-C7 U2
ESP32-S3-WROOM Powering: C8 C9 R3 U1
Powering Led: D1 R2

### Ports
+3V3 (see Master[2B]), +5V (see Master[2B]), GND (see Master[2B])

### Nets
+3V3: C6.2 C7.2 R2.2 R3.2 U2.2(VOUT) ; port +3V3
+5V: C4.2 C5.2 U2.3(VIN) ; port +5V
ESP_3V3: C8.2 C9.2 R3.1 U1.2(3V3)
GND: C4.1 C5.1 C6.1 C7.1 C8.1 C9.1 D1.C U1.1(GND) U2.1(GND) U2.4(TAB) ; port GND
LED_RES: D1.A R2.1

### Notes on the sheet
- (near R3) Populating @{"Id":"IUQRSIKL\HDHVYVYZ","ObjectType":2} make the regulator deliver power to the ESP32. Otherwise, it should be powered vy external source via the UI 3.3V pins.

### Library data of the parts
C4 C6 C8 = 0402 SMD Capacitor: as C2 on sheet ESP32-S3-WROOM; ComponentLink1Description: Link; ComponentLink1URL: *; Supplier: Digikey; Supplier Part Number: 1276-6720-1-ND; RoHS: Yes; Category: Ceramic Capacitors; Stock: 9938397; Pricing: 1=0.08, 10=0.006, 50=0.0056, 100=0.0048, 500=0.0044, 1000=0.004, 2500=0.0032 (USD); Mounting Technology: Surface Mount; Case/Package: 0402; Case Code (Metric): 1005; Case Code (Imperial): 0402; Min Operating Temperature: -55°C; Max Operating Temperature: 125°C; Packaging: Cut Tape; Tolerance: 10%; Series: CL; Voltage Rating (DC): 25V; Length: 0.039inch; Width: 0.02inch; Height: 550um; Thickness: 0.022inch; RoHS Compliant: Yes; ComponentLink2URL: https://datasheet.octopart.com/CL05B104KA5NNNC-Samsung-Electro-Mechanics-datasheet-116890910.pdf?src-supplier=Future+Electronics; ComponentLink2Description: https://datasheet.octopart.com/CL05B104KA5NNNC-Samsung-Electro-Mechanics-datasheet-116890910.pdf?src-supplier=Future+Electronics; ComponentLink3URL: http://www.samsungsem.com/kr/support/product-search/mlcc/CL05B104KA5NNNC.jsp?src-supplier=Digikey; ComponentLink3Description: http://www.samsungsem.com/kr/support/product-search/mlcc/CL05B104KA5NNNC.jsp?src-supplier=Digikey
C5 C7 C9 = 0603 SMD CAP: as C11 on sheet CP2102; Supplier: Mouser; Supplier Part Number: 81-GRM188R61E106KA3D; RoHS: Yes; Category: Ceramic Capacitors; Stock: 343973; Pricing: 1=0.22, 10=0.073, 50=0.073, 100=0.054, 1000=0.05, 10000=0.038 (USD); Length: 1.6mm; Width: 800um; Height: 1mm; Thickness: 800um; ComponentLink1URL: https://datasheet.octopart.com/GRM188R61E106KA73D-Murata-datasheet-149523249.pdf?src-supplier=Newark; ComponentLink1Description: https://datasheet.octopart.com/GRM188R61E106KA73D-Murata-datasheet-149523249.pdf?src-supplier=Newark; ComponentLink2URL: https://search.murata.co.jp/Ceramy/image/img/A01X/G101/ENG/GRM188R61E106KA73-01.pdf?src-supplier=Digikey; ComponentLink2Description: https://search.murata.co.jp/Ceramy/image/img/A01X/G101/ENG/GRM188R61E106KA73-01.pdf?src-supplier=Digikey; ComponentLink3URL: https://datasheet.octopart.com/GRM188R61E106KA73D-Murata-datasheet-165579666.pdf?src-supplier=TME; ComponentLink3Description: https://datasheet.octopart.com/GRM188R61E106KA73D-Murata-datasheet-165579666.pdf?src-supplier=TME
D1 = 597-3305-607F: LED Uni-Color Red 2-Pin Chip 0805 T/R; Availability: Unavailable; Value: *; Price: None; MP: 597-3305-607F; Package: None
R2 = 0402 SMD Resistor: as R4 on sheet Connectors; Resistance: *; Part Number: *; ComponentLink1Description: Link; ComponentLink1URL: *; Tolerance: *; Wattage: *; Supplier: Digikey; Supplier Part Number: 13-RC0402FR-7W5K1LCT-ND; RoHS: Yes; Category: Chip SMD Resistors; Stock: 6352; Pricing: 1=0.1, 10=0.021, 50=0.0164, 100=0.0112, 500=0.00868, 1000=0.00612, 5000=0.0051 (USD); Case/Package: 343Case; Packaging: 10Packaging; RoHS Compliant: Yes
R3 = 0402 SMD Resistor: as R10 on sheet CP2102; ComponentLink1Description: Link; ComponentLink1URL: *; Supplier: Mouser; Supplier Part Number: 667-ERJ-2GE0R00X; RoHS: Yes; Category: Chip SMD Resistors; Stock: 616486; Pricing: 1=0.1, 10=0.013, 50=0.013, 100=0.008, 1000=0.006, 10000=0.004 (USD); Mounting Technology: Surface Mount; Case/Package: 0402; Pins: 2NUMBER; Contact Plating: Tin; Case Code (Metric): 1005; Case Code (Imperial): 0402; Min Operating Temperature: -55°C; Max Operating Temperature: 155°C; Resistor Type: Thick Film; Packaging: Cut Tape; Package Quantity: 10000; Number of Terminations: 2; Termination: SMD/SMT; Max Power Dissipation: 100mW; Features: Automotive AEC-Q200; Series: ERJ; Construction: Rectangular; Technology: THICK FILM; Voltage Rating (DC): 50V; Length: 1mm; Width: 0.5mm; Height: 0.35mm; Depth: 0.5mm; Ratings: AEC-Q200; Radiation Hardening: No; Reach SVHC Compliant: No; Military Standard: Not; RoHS Compliant: Yes; Lead Free: 5697LeadFree; ComponentLink2URL: https://datasheet.ciiva.com/11821/0900766b80f806dd-11821176.pdf?src-supplier=Rs; ComponentLink2Description: https://datasheet.ciiva.com/11821/0900766b80f806dd-11821176.pdf?src-supplier=Rs; ComponentLink3URL: https://datasheet.ciiva.com/46389/1678796-46389518.pdf?src-supplier=Element14; ComponentLink3Description: https://datasheet.ciiva.com/46389/1678796-46389518.pdf?src-supplier=Element14; ComponentLink4URL: https://datasheet.ciiva.com/28695/1678796-28695758.pdf?src-supplier=Element14; ComponentLink4Description: https://datasheet.ciiva.com/28695/1678796-28695758.pdf?src-supplier=Element14; ComponentLink5URL: https://datasheet.ciiva.com/16778/70260739-16778335.pdf?src-supplier=Allied+Electronics; ComponentLink5Description: https://datasheet.ciiva.com/16778/70260739-16778335.pdf?src-supplier=Allied+Electronics; ComponentLink6URL: https://datasheet.ciiva.com/48531/aoa0000ce1-48531077.pdf?src-supplier=Avnet; ComponentLink6Description: https://datasheet.ciiva.com/48531/aoa0000ce1-48531077.pdf?src-supplier=Avnet; ComponentLink7URL: https://datasheet.ciiva.com/30097/4aoa0000ce1-30097116.pdf?src-supplier=Onlinecomponents.com; ComponentLink7Description: https://datasheet.ciiva.com/30097/4aoa0000ce1-30097116.pdf?src-supplier=Onlinecomponents.com; ComponentLink8URL: https://datasheet.ciiva.com/43460/1678796-43460347.pdf?src-supplier=Farnell; ComponentLink8Description: https://datasheet.ciiva.com/43460/1678796-43460347.pdf?src-supplier=Farnell; ComponentLink9URL: https://datasheet.ciiva.com/5959/1678796-5959692.pdf?src-supplier=Farnell; ComponentLink9Description: https://datasheet.ciiva.com/5959/1678796-5959692.pdf?src-supplier=Farnell; ComponentLink10URL: https://datasheet.ciiva.com/16783/70260739-16783734.pdf?src-supplier=Allied+Electronics; ComponentLink10Description: https://datasheet.ciiva.com/16783/70260739-16783734.pdf?src-supplier=Allied+Electronics
U1 = ESP32-S3-WROOM-1-N8: <a href="https://pricing.snapeda.com/parts/ESP32S3WROOM1N8R8/Espressif%20Systems/view-part?ref=eda">Check availability</a>  <a href="https://pricing.snapeda.com/parts/ESP32-S3-WROOM-1-N8R8/Espressif%20Systems/view-part?ref=eda">Check availability</a>; pin to pad: 1>1+40+41_1+41_2+41_3+41_4+41_5+41_6+41_7+41_8+41_9+41_10+41_11+41_12+41_13+41_14+41_15+41_16+41_17+41_18+41_19+41_20+41_21; MF: {'manufacturer': u'Espressif Systems'}; Package: None; Price: None; Value: *; MP: ESP32-S3-WROOM-1-N8; Availability: Unavailable
U2 = AMS1117-3.3: Sot223/Pkg 1-Amp 3.3-Volt Low Drop Out Voltage Regulatator; MF: Advanced Monolithic Systems; Package: SOT-223 Seeed Technology; Value: *; Check_prices: https://www.snapeda.com/parts/AMS1117-3.3/Advanced+Monolithic+Systems/view-part/?ref=eda; Price: None; Availability: Not in stock; MP: AMS1117-3.3; SnapEDA_Link: https://www.snapeda.com/parts/AMS1117-3.3/Advanced+Monolithic+Systems/view-part/?ref=snap

## Sheet RGB_LED.SchDoc
size A; SheetNumber: 7; SheetTotal: 7
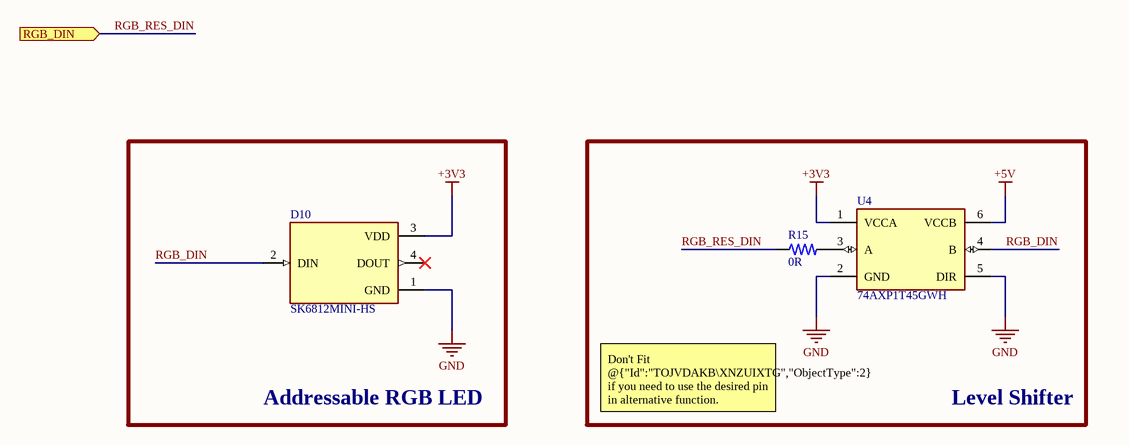
[diagram p5: RGB_LED.SchDoc]

### Parts
D10  SK6812MINI-HS  [LED_SK6812MINI-HS]
R15  0R  [0402 RES]
U4  74AXP1T45GWH  [SOT65P210X110-6N]

### Blocks framed on the sheet
Addressable RGB LED: D10
Level Shifter: R15 U4

### Ports
RGB_DIN (in, see Master[2C])

### Nets
+3V3: D10.3(VDD) U4.1(VCCA)
+5V: U4.6(VCCB)
GND: D10.1(GND) U4.2(GND) U4.5(DIR)
RGB_DIN: D10.2(DIN) U4.4(B)
RGB_RES_DIN: R15.1 ; port RGB_DIN  [project net IO38]
NetR15_2: R15.2 U4.3(A)

Not connected (* = marked no-connect by the designer): D10 4(DOUT)*

### Notes on the sheet
- Don't Fit @{"Id":"TOJVDAKB\XNZUIXTG","ObjectType":2} if you need to use the desired pin in alternative function.

### Library data of the parts
D10 = SK6812MINI-HS: INTEGRATED LIGHT SOURCE INTELLIGENT CONTROL OF CHIP-ON-TOP SMD TYPE LED; MF: DONGGUANG OPSCO OPTOELECTRONICS CO., LTD; MP: SK6812MINI-012; SnapEDA_Link: https://www.snapeda.com/parts/SK6812MINI-012/DONGGUANG+OPSCO+OPTOELECTRONICS+CO.%252C+LTD/view-part/?ref=snap; Package: Package; Value: *; Check_prices: https://www.snapeda.com/parts/SK6812MINI-012/DONGGUANG+OPSCO+OPTOELECTRONICS+CO.%252C+LTD/view-part/?ref=eda
R15 = 0402 SMD Resistor: as R10 on sheet CP2102; ComponentLink1Description: Link; ComponentLink1URL: *; Supplier: Mouser; Supplier Part Number: 667-ERJ-2GE0R00X; RoHS: Yes; Category: Chip SMD Resistors; Stock: 616486; Pricing: 1=0.1, 10=0.013, 50=0.013, 100=0.008, 1000=0.006, 10000=0.004 (USD); Mounting Technology: Surface Mount; Case/Package: 0402; Pins: 2NUMBER; Contact Plating: Tin; Case Code (Metric): 1005; Case Code (Imperial): 0402; Min Operating Temperature: -55°C; Max Operating Temperature: 155°C; Resistor Type: Thick Film; Packaging: Cut Tape; Package Quantity: 10000; Number of Terminations: 2; Termination: SMD/SMT; Max Power Dissipation: 100mW; Features: Automotive AEC-Q200; Series: ERJ; Construction: Rectangular; Technology: THICK FILM; Voltage Rating (DC): 50V; Length: 1mm; Width: 0.5mm; Height: 0.35mm; Depth: 0.5mm; Ratings: AEC-Q200; Radiation Hardening: No; Reach SVHC Compliant: No; Military Standard: Not; RoHS Compliant: Yes; Lead Free: 5697LeadFree; ComponentLink2URL: https://datasheet.ciiva.com/11821/0900766b80f806dd-11821176.pdf?src-supplier=Rs; ComponentLink2Description: https://datasheet.ciiva.com/11821/0900766b80f806dd-11821176.pdf?src-supplier=Rs; ComponentLink3URL: https://datasheet.ciiva.com/46389/1678796-46389518.pdf?src-supplier=Element14; ComponentLink3Description: https://datasheet.ciiva.com/46389/1678796-46389518.pdf?src-supplier=Element14; ComponentLink4URL: https://datasheet.ciiva.com/28695/1678796-28695758.pdf?src-supplier=Element14; ComponentLink4Description: https://datasheet.ciiva.com/28695/1678796-28695758.pdf?src-supplier=Element14; ComponentLink5URL: https://datasheet.ciiva.com/16778/70260739-16778335.pdf?src-supplier=Allied+Electronics; ComponentLink5Description: https://datasheet.ciiva.com/16778/70260739-16778335.pdf?src-supplier=Allied+Electronics; ComponentLink6URL: https://datasheet.ciiva.com/48531/aoa0000ce1-48531077.pdf?src-supplier=Avnet; ComponentLink6Description: https://datasheet.ciiva.com/48531/aoa0000ce1-48531077.pdf?src-supplier=Avnet; ComponentLink7URL: https://datasheet.ciiva.com/30097/4aoa0000ce1-30097116.pdf?src-supplier=Onlinecomponents.com; ComponentLink7Description: https://datasheet.ciiva.com/30097/4aoa0000ce1-30097116.pdf?src-supplier=Onlinecomponents.com; ComponentLink8URL: https://datasheet.ciiva.com/43460/1678796-43460347.pdf?src-supplier=Farnell; ComponentLink8Description: https://datasheet.ciiva.com/43460/1678796-43460347.pdf?src-supplier=Farnell; ComponentLink9URL: https://datasheet.ciiva.com/5959/1678796-5959692.pdf?src-supplier=Farnell; ComponentLink9Description: https://datasheet.ciiva.com/5959/1678796-5959692.pdf?src-supplier=Farnell; ComponentLink10URL: https://datasheet.ciiva.com/16783/70260739-16783734.pdf?src-supplier=Allied+Electronics; ComponentLink10Description: https://datasheet.ciiva.com/16783/70260739-16783734.pdf?src-supplier=Allied+Electronics
U4 = 74AXP1T45GWH: Voltage Level Translator Bidirectional 1 Circuit 1 Channel - 6-TSSOP; MF: Nexperia; Check_prices: https://www.snapeda.com/parts/74AXP1T45GWH/Nexperia/view-part/?ref=eda; Value: *; Availability: In Stock; Price: None; Package: TSSOP6-6 Nexperia USA Inc.; MP: 74AXP1T45GWH; SnapEDA_Link: https://www.snapeda.com/parts/74AXP1T45GWH/Nexperia/view-part/?ref=snap; Purchase-URL: https://pricing.snapeda.com/search/part/74AXP1T45GWH/?ref=eda

## Sheet AutoProgram.SchDoc
size A; SheetNumber: 6; SheetTotal: 7
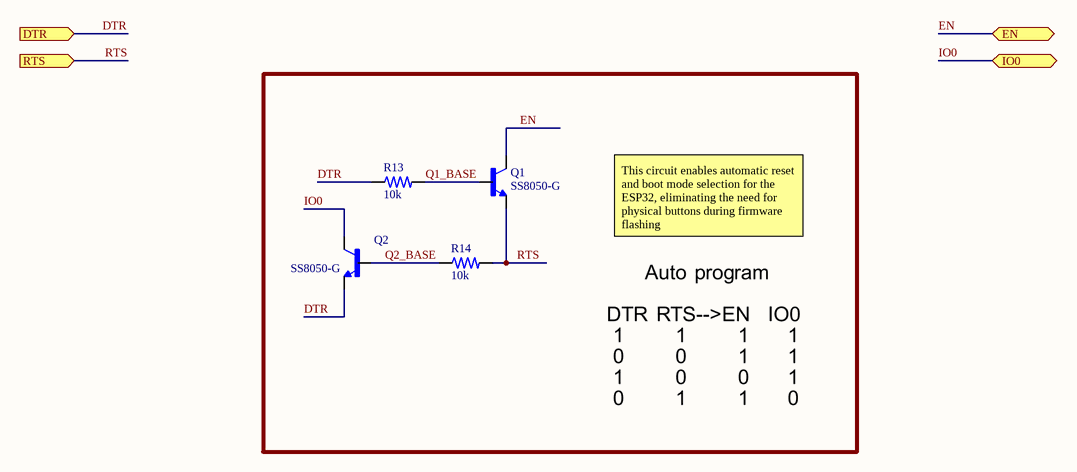
[diagram p6: AutoProgram.SchDoc]

### Parts
Q1  SS8050-G  [TRANS_SS8050-G]
Q2  SS8050-G  [TRANS_SS8050-G]
R13  10k  [0402 RES]
R14  10k  [0402 RES]

### Ports
DTR (in, see Master[2C]), EN (bidir, see Master[2C], ESP32-S3-WROOM[3C]), IO0 (bidir, see Master[2C], ESP32-S3-WROOM[3C]), RTS (in, see Master[2C])

### Nets
DTR: Q2.2(E) R13.1 ; port DTR
EN: Q1.3(C) ; port EN
IO0: Q2.3(C) ; port IO0
Q1_BASE: Q1.1(B) R13.2
Q2_BASE: Q2.1(B) R14.1
RTS: Q1.2(E) R14.2 ; port RTS

### Notes on the sheet
- This circuit enables automatic reset and boot mode selection for the ESP32, eliminating the need for physical buttons during firmware flashing

### Library data of the parts
Q1 Q2 = SS8050-G: Bipolar (BJT) Transistor NPN 25 V 1.5 A 100MHz 300 mW Surface Mount SOT-23-3; MP: SS8050G; MF: Comchip; Digi-Key_Part_Number: 641-1790-2-ND; Check_prices: https://www.snapeda.com/parts/SS8050G/Comchip/view-part/?ref=eda; Package: None; SnapEDA_Link: https://www.snapeda.com/parts/SS8050G/Comchip/view-part/?ref=snap; Value: *
R13 R14 = 0402 SMD Resistor: as R1 on sheet ESP32-S3-WROOM; ComponentLink1Description: Link; ComponentLink1URL: *; Supplier: Future Electronics; Supplier Part Number: 5143940; RoHS: Yes; Category: Chip SMD Resistors; Stock: 480000; Pricing: 10000=0.0009, 50000=0.0009, 200000=0.0009, 500000=0.0009, 1250000=0.0009 (USD); Case/Package: 343Case; Packaging: 10Packaging; RoHS Compliant: Yes; ComponentLink2URL: https://datasheet.octopart.com/RC0402JR-7W10KL-Yageo-datasheet-164759695.pdf?src-supplier=Future+Electronics; ComponentLink2Description: https://datasheet.octopart.com/RC0402JR-7W10KL-Yageo-datasheet-164759695.pdf?src-supplier=Future+Electronics

## Nets that join several sheets
+3V3: ESP32-S3-WROOM (R1.2), CP2102 (5 pins), Powering (5 pins), RGB_LED (D10.3 U4.1)
+5V: Connectors (D2.C D3.C P1.21), CP2102 (R9.2), Powering (C4.2 C5.2 U2.3), RGB_LED (U4.6)
ESP_3V3: Connectors (P1.1 P1.2), Powering (C8.2 C9.2 R3.1 U1.2)
GND: ESP32-S3-WROOM (7 pins), Connectors (26 pins), CP2102 (7 pins), Powering (10 pins), RGB_LED (D10.1 U4.2 U4.5)
CP2102_RES_RXD: ESP32-S3-WROOM (U1.37), Connectors (P2.2), CP2102 (R11.2)
CP2102_RES_TXD: ESP32-S3-WROOM (U1.36), Connectors (P2.3), CP2102 (R10.2)
CP2102_USB_D_N: Connectors (D5.2 J1.A7 J1.B7), CP2102 (U3.5)
CP2102_USB_D_P: Connectors (D4.2 J1.A6 J1.B6), CP2102 (U3.4)
DTR: CP2102 (U3.28), AutoProgram (Q2.2 R13.1)
EN: ESP32-S3-WROOM (6 pins), Connectors (P1.3), AutoProgram (Q1.3)
IO0: ESP32-S3-WROOM (C3.2 SW2.3 SW2.4 U1.27), Connectors (P2.14), AutoProgram (Q2.3)
IO1: ESP32-S3-WROOM (U1.39), Connectors (P2.4)
IO2: ESP32-S3-WROOM (U1.38), Connectors (P2.5)
IO3: ESP32-S3-WROOM (U1.15), Connectors (P1.13)
IO4: ESP32-S3-WROOM (U1.4), Connectors (P1.4)
IO5: ESP32-S3-WROOM (U1.5), Connectors (P1.5)
IO6: ESP32-S3-WROOM (U1.6), Connectors (P1.6)
IO7: ESP32-S3-WROOM (U1.7), Connectors (P1.7)
IO8: ESP32-S3-WROOM (U1.12), Connectors (P1.12)
IO9: ESP32-S3-WROOM (U1.17), Connectors (P1.15)
IO10: ESP32-S3-WROOM (U1.18), Connectors (P1.16)
IO11: ESP32-S3-WROOM (U1.19), Connectors (P1.17)
IO12: ESP32-S3-WROOM (U1.20), Connectors (P1.18)
IO13: ESP32-S3-WROOM (U1.21), Connectors (P1.19)
IO14: ESP32-S3-WROOM (U1.22), Connectors (P1.20)
IO15: ESP32-S3-WROOM (U1.8), Connectors (P1.8)
IO16: ESP32-S3-WROOM (U1.9), Connectors (P1.9)
IO17: ESP32-S3-WROOM (U1.10), Connectors (P1.10)
IO18: ESP32-S3-WROOM (U1.11), Connectors (P1.11)
IO21: ESP32-S3-WROOM (U1.23), Connectors (P2.18)
IO35: ESP32-S3-WROOM (U1.28), Connectors (P2.13)
IO36: ESP32-S3-WROOM (U1.29), Connectors (P2.12)
IO37: ESP32-S3-WROOM (U1.30), Connectors (P2.11)
IO38: ESP32-S3-WROOM (U1.31), Connectors (P2.10), RGB_LED (R15.1)
IO39: ESP32-S3-WROOM (U1.32), Connectors (P2.9)
IO40: ESP32-S3-WROOM (U1.33), Connectors (P2.8)
IO41: ESP32-S3-WROOM (U1.34), Connectors (P2.7)
IO42: ESP32-S3-WROOM (U1.35), Connectors (P2.6)
IO45: ESP32-S3-WROOM (U1.26), Connectors (P2.15)
IO46: ESP32-S3-WROOM (U1.16), Connectors (P1.14)
IO47: ESP32-S3-WROOM (U1.24), Connectors (P2.17)
IO48: ESP32-S3-WROOM (U1.25), Connectors (P2.16)
RTS: CP2102 (U3.24), AutoProgram (Q1.2 R14.2)
USB1_D_N: ESP32-S3-WROOM (U1.13), Connectors (D7.2 J2.A7 J2.B7 P2.20)
USB1_D_P: ESP32-S3-WROOM (U1.14), Connectors (D6.2 J2.A6 J2.B6 P2.19)